# Altium schematic sheet Sheet1.SchDoc
size A4
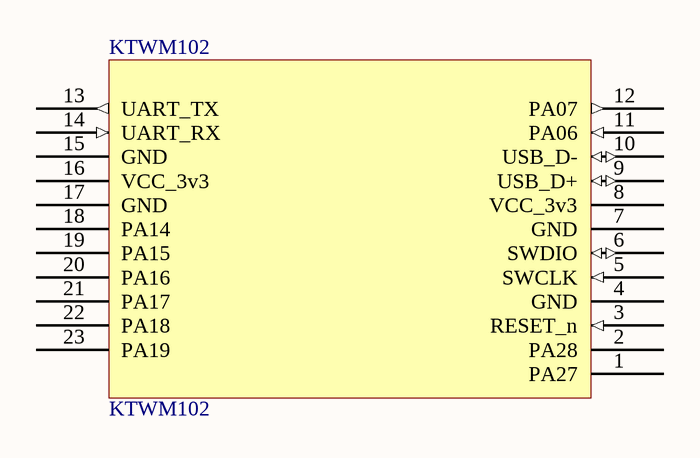
[diagram p0: Sheet1.SchDoc]

## Parts
KTWM102  KTWM102  [KTWM102]

## Nets

Not connected (* = marked no-connect by the designer): KTWM102 1(PA27) 2(PA28) 3(RESET_n) 4(GND) 5(SWCLK) 6(SWDIO) 7(GND) 8(VCC_3v3) 9(USB_D+) 10(USB_D-) 11(PA06) 12(PA07) 13(UART_TX) 14(UART_RX) 15(GND) 16(VCC_3v3) 17(GND) 18(PA14) 19(PA15) 20(PA16) 21(PA17) 22(PA18) 23(PA19)

## Library data of the parts
KTWM102 = KTWM102: https://www.kirale.com/products/ktwm102/